# Altium schematic sheet bcan_adapter.SchDoc
size A
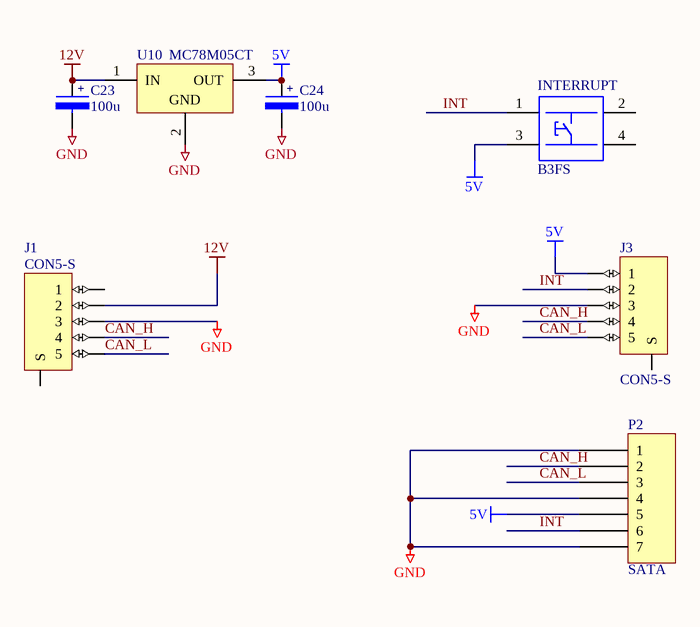
[diagram p0: bcan_adapter.SchDoc]

## Parts
C23  100u  [HDR1X2C]
C24  100u  [HDR1X2C]
INTERRUPT  B3FS  [smd_switch]
J1  CON5-S  [TRIAD5F]
J3  CON5-S  [TRIAD5F]
P2  SATA  [47080-4005-SATA]
U10  MC78M05CT  [TO-220-UP]

## Nets
5V: C24.1 INTERRUPT.3(B2) J3.1 P2.5 U10.3(OUT)
12V: C23.1 J1.2 U10.1(IN)
GND: C23.2 C24.2 J1.3 J3.3 P2.1 P2.4 P2.7 U10.2(GND)
CAN_H: J1.4 J3.4 P2.2
CAN_L: J1.5 J3.5 P2.3
INT: INTERRUPT.1(A1) J3.2 P2.6

Not connected (* = marked no-connect by the designer): INTERRUPT 2(A2) 4(B1); J1 0(S) 1; J3 0(S)

## Notes on the sheet
- (in symbol CAP-POL) +

## Library data of the parts
C23 C24 = CAP-POL: Capacitor
INTERRUPT = B3FS: SMD tactile switch; OMRON: B3FS-1052; Farnell: 3121197; Digikey: SW792-ND
J1 J3 = CON5-S: Connector, 2 pin, with shield @ S; Farnell: .131-040; Price: 19.32
U10 = MC78M05CT: 3-Terminal Medium-Current Positive Fixed Voltage Regulator; Note: Pin 2 is electrically connected to TAB; Code - JEDEC: TO-262-AA; Published: 17-Jul-2002; Datasheet: Linear and Interface Integrated Circuits, DL128 Rev2 (1988); Package Reference: 221A-04; Publisher: Altium Limited